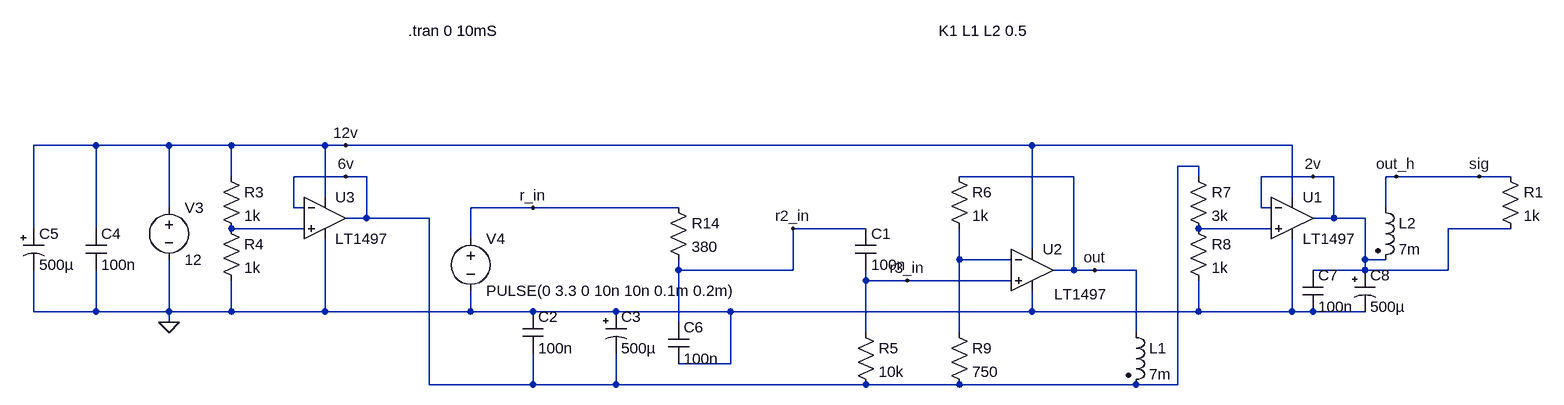
[diagram p0: schematic res2.2.asc]
res2.2.asc, the LTspice schematic file:
Version 4
SHEET 1 3956 960
WIRE 1184 128 1088 128
WIRE 1296 128 1184 128
WIRE 1392 128 1296 128
WIRE 1536 128 1392 128
WIRE 1568 128 1536 128
WIRE 2624 128 1568 128
WIRE 3024 128 2624 128
WIRE 2880 160 2848 160
WIRE 1392 176 1392 128
WIRE 1568 176 1488 176
WIRE 1600 176 1568 176
WIRE 2688 176 2512 176
WIRE 2880 176 2880 160
WIRE 3056 176 2976 176
WIRE 3088 176 3056 176
WIRE 3184 176 3168 176
WIRE 3312 176 3184 176
WIRE 3360 176 3312 176
WIRE 1536 208 1536 128
WIRE 3024 208 3024 128
WIRE 1296 224 1296 128
WIRE 1488 224 1488 176
WIRE 1504 224 1488 224
WIRE 1856 224 1760 224
WIRE 2080 224 1856 224
WIRE 2976 224 2976 176
WIRE 2992 224 2976 224
WIRE 3168 224 3168 176
WIRE 1600 240 1600 176
WIRE 1600 240 1568 240
WIRE 1696 240 1600 240
WIRE 3088 240 3088 176
WIRE 3088 240 3056 240
WIRE 3136 240 3088 240
WIRE 1088 256 1088 128
WIRE 1184 256 1184 128
WIRE 1504 256 1392 256
WIRE 2368 256 2256 256
WIRE 2992 256 2880 256
WIRE 3360 256 3264 256
WIRE 1760 272 1760 224
WIRE 2624 288 2624 128
WIRE 2512 304 2512 256
WIRE 2592 304 2512 304
WIRE 3136 304 3136 240
WIRE 3168 304 3136 304
WIRE 2080 320 2080 304
WIRE 2256 320 2256 256
WIRE 2256 320 2080 320
WIRE 2688 320 2688 176
WIRE 2688 320 2656 320
WIRE 2720 320 2688 320
WIRE 2784 320 2720 320
WIRE 3136 320 3136 304
WIRE 3136 320 3056 320
WIRE 3264 320 3264 256
WIRE 3264 320 3136 320
WIRE 2368 336 2368 320
WIRE 2432 336 2368 336
WIRE 2592 336 2432 336
WIRE 1088 384 1088 320
WIRE 1184 384 1184 320
WIRE 1184 384 1088 384
WIRE 1296 384 1296 304
WIRE 1296 384 1184 384
WIRE 1392 384 1392 336
WIRE 1392 384 1296 384
WIRE 1536 384 1536 272
WIRE 1536 384 1392 384
WIRE 1760 384 1760 352
WIRE 1760 384 1536 384
WIRE 1856 384 1760 384
WIRE 1984 384 1856 384
WIRE 2160 384 1984 384
WIRE 2624 384 2624 352
WIRE 2624 384 2160 384
WIRE 2880 384 2880 336
WIRE 2880 384 2624 384
WIRE 3024 384 3024 272
WIRE 3024 384 2880 384
WIRE 3056 384 3024 384
WIRE 3136 384 3056 384
WIRE 1296 400 1296 384
WIRE 2080 400 2080 320
WIRE 2368 416 2368 336
WIRE 2512 416 2512 304
WIRE 2784 416 2784 320
WIRE 2160 464 2160 384
WIRE 2160 464 2080 464
WIRE 1696 496 1696 240
WIRE 1856 496 1856 448
WIRE 1856 496 1696 496
WIRE 1984 496 1984 448
WIRE 1984 496 1856 496
WIRE 2368 496 1984 496
WIRE 2512 496 2368 496
WIRE 2784 496 2512 496
WIRE 2848 496 2848 160
WIRE 2848 496 2784 496
FLAG 1296 400 0
FLAG 1568 176 6v
FLAG 2720 320 out
FLAG 3312 176 sig
FLAG 1856 224 r_in
FLAG 2256 256 r2_in
FLAG 2432 336 r3_in
FLAG 3184 176 out_h
FLAG 3056 176 2v
FLAG 1568 128 12v
SYMBOL voltage 1296 208 R0
SYMATTR InstName V3
SYMATTR Value 12
SYMATTR SpiceLine Rser=1
SYMBOL res 1376 160 R0
SYMATTR InstName R3
SYMATTR Value 1k
SYMBOL res 1376 240 R0
SYMATTR InstName R4
SYMATTR Value 1k
SYMBOL ind2 2768 400 R0
SYMATTR InstName L1
SYMATTR Value 7m
SYMATTR Type ind
SYMATTR SpiceLine Rser=30
SYMBOL Opamps/LT1497 2624 256 R0
WINDOW 3 34 101 Left 2
SYMATTR InstName U2
SYMBOL ind2 3152 208 R0
SYMATTR InstName L2
SYMATTR Value 7m
SYMATTR SpiceLine Rser=70
SYMBOL res 2352 400 R0
SYMATTR InstName R5
SYMATTR Value 10k
SYMBOL cap 2352 256 R0
SYMATTR InstName C1
SYMATTR Value 100n
SYMBOL res 2496 160 R0
SYMATTR InstName R6
SYMATTR Value 1k
SYMBOL res 2496 400 R0
SYMATTR InstName R9
SYMATTR Value 750
SYMBOL Opamps/LT1497 1536 176 R0
SYMATTR InstName U3
SYMBOL voltage 1760 256 R0
SYMATTR InstName V4
SYMATTR Value PULSE(0 3.3 0 10n 10n 0.1m 0.2m)
SYMATTR SpiceLine Rser=1
SYMBOL cap 2064 400 R0
SYMATTR InstName C6
SYMATTR Value 100n
SYMBOL res 2064 208 R0
SYMATTR InstName R14
SYMATTR Value 380
SYMBOL res 3344 160 R0
SYMATTR InstName R1
SYMATTR Value 1k
SYMBOL res 2864 160 R0
SYMATTR InstName R7
SYMATTR Value 3k
SYMBOL res 2864 240 R0
SYMATTR InstName R8
SYMATTR Value 1k
SYMBOL Opamps/LT1497 3024 176 R0
SYMATTR InstName U1
SYMBOL cap 1840 384 R0
SYMATTR InstName C2
SYMATTR Value 100n
SYMBOL polcap 1968 384 R0
SYMATTR InstName C3
SYMATTR Value 500µ
SYMBOL cap 1168 256 R0
SYMATTR InstName C4
SYMATTR Value 100n
SYMBOL polcap 1072 256 R0
SYMATTR InstName C5
SYMATTR Value 500µ
SYMBOL cap 3040 320 R0
SYMATTR InstName C7
SYMATTR Value 100n
SYMBOL polcap 3120 320 R0
SYMATTR InstName C8
SYMATTR Value 500µ
TEXT 1664 -48 Left 2 !.tran 0 10mS
TEXT 2480 -48 Left 2 !K1 L1 L2 0.5

The netlist it stands for:
* res2.2.asc
V3 12v 0 12 Rser=1
R3 12v N001 1k
R4 N001 0 1k
L1 out 6v 7m Rser=30
XU2 r3_in N003 12v 0 out LT1497  ; pins In+ In- V+ V- OUT
L2 out_h 2v 7m Rser=70
R5 r3_in 6v 10k
C1 r2_in r3_in 100n
R6 out N003 1k
R9 N003 6v 750
XU3 N001 6v 12v 0 6v LT1497  ; pins In+ In- V+ V- OUT
V4 r_in 0 PULSE(0 3.3 0 10n 10n 0.1m 0.2m) Rser=1
C6 r2_in 0 100n
R14 r_in r2_in 380
R1 out_h 2v 1k
R7 6v N002 3k
R8 N002 0 1k
XU1 N002 2v 12v 0 2v LT1497  ; pins In+ In- V+ V- OUT
C2 0 6v 100n
C3 0 6v 500µ
C4 12v 0 100n
C5 12v 0 500µ
C7 2v 0 100n
C8 2v 0 500µ
.tran 0 10mS
K1 L1 L2 0.5
.backanno
.end